# EAGLE design Quad_ESC_controller (EAGLE 9.6.2)
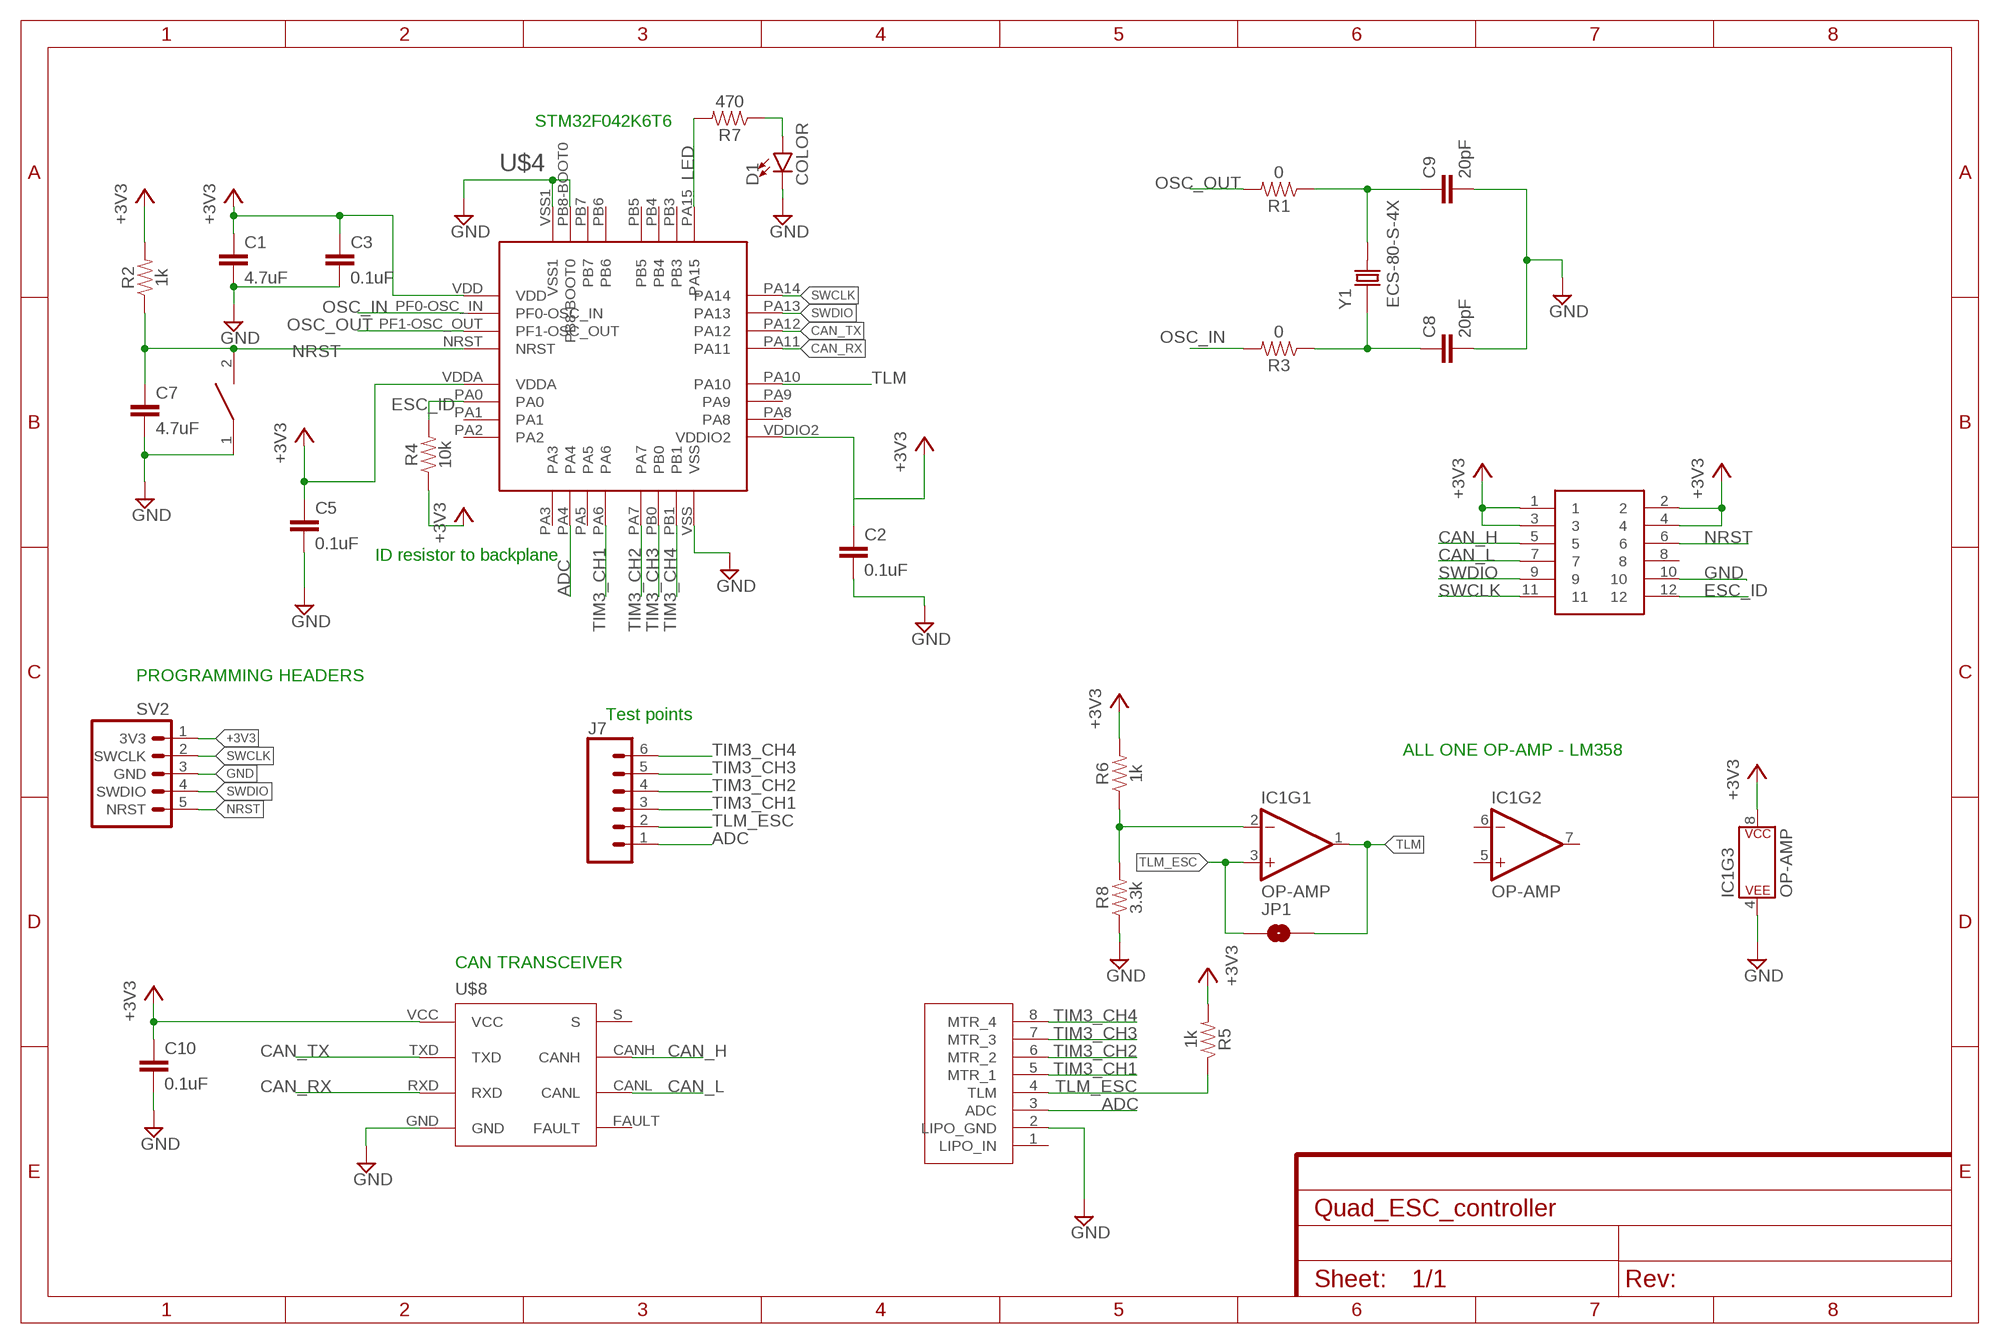
[diagram p0: schematic, sheet 1]

## Parts
C1  4.7uF  4.7UF0603  [0603]
C2  0.1uF  4.7UF0603  [0603]
C3  0.1uF  4.7UF0603  [0603]
C5  0.1uF  4.7UF0603  [0603]
C7  4.7uF  4.7UF0603  [0603]
C8  20pF  4.7UF0603  [0603]
C9  20pF  4.7UF0603  [0603]
C10  0.1uF  4.7UF0603  [0603]
D1  COLOR  LED-0805  [0805]
IC1  OP-AMP  OPAMP-DUALU  [SO08]
J7  CONN_06SILK_FEMALE_PTH  [1X06]
JP1  JUMPER-SMT_2_NO_SILK  [SMT-JUMPER_2_NO_SILK]
R1  0  1KOHM-0603-1/10W-1%  [0603]
R2  1k  1KOHM-0603-1/10W-1%  [0603]
R3  0  1KOHM-0603-1/10W-1%  [0603]
R4  10k  10KOHM-0603-1/10W-1%  [0603]
R5  1k  RESISTOR0603  [0603]
R6  1k  RESISTOR0603  [0603]
R7  470  RESISTOR0603  [0603]
R8  3.3k  RESISTOR0603  [0603]
RESET  DISCRETECOMPONENTS_SWITCH  [DISCRETECOMPONENTS_SW_2512]
SV2  3V3 -SWCLK-GND-SWDIO- NRST  SWD_CONN  [1X05]
U$2  JST-8PIN  [8PIN_CONNECTOR]
U$3  BACKPLANE_CONNECTORSESC  [BACKPLANE_CONNECTORS_ESC]
U$4  STM32F042K6T6  [STM32F042K6T6]
U$8  TCAN337D  [TCAN337D]
Y1  ECS-80-S-4X  [XTAL_ECS-80-S-4X]

## Nets
+3V3: C1.1 C2.1 C3.1 C5.1 C10.1 IC1.8(P$V+) R2.2 R4.1 R5.2 R6.2 SV2.1(3V3) U$3.1 U$3.2 U$3.3 U$3.4 U$4.VDD U$4.VDDA U$4.VDDIO2 U$8.VCC
ADC: J7.1 U$2.3(ADC) U$4.PA4
CAN_H: U$3.5 U$8.CANH
CAN_L: U$3.7 U$8.CANL
CAN_RX: U$4.PA11 U$8.RXD
CAN_TX: U$4.PA12 U$8.TXD
ESC_ID: R4.2 U$3.12 U$4.PA0
GND: C1.2 C2.2 C3.2 C5.2 C7.2 C8.2 C9.2 C10.2 D1.C IC1.4(P$V-) R8.1 RESET.1 SV2.3(GND) U$2.2(LIPO_GND) U$3.10 U$4.PB8-BOOT0 U$4.VSS U$4.VSS1 U$8.GND
LED: R7.2 U$4.PA15
N$1: C9.1 R1.1 Y1.2
N$2: C8.1 R3.1 Y1.1
N$6: IC1.2(-IN) R6.1 R8.2
N$24: D1.A R7.1
NRST: C7.1 R2.1 RESET.2 SV2.5(NRST) U$3.6 U$4.NRST
OSC_IN: R3.2 U$4.PF0-OSC_IN
OSC_OUT: R1.2 U$4.PF1-OSC_OUT
SWCLK: SV2.2(SWCLK) U$3.11 U$4.PA14
SWDIO: SV2.4(SWDIO) U$3.9 U$4.PA13
TIM3_CH1: J7.3 U$2.5(MTR_1) U$4.PA6
TIM3_CH2: J7.4 U$2.6(MTR_2) U$4.PA7
TIM3_CH3: J7.5 U$2.7(MTR_3) U$4.PB0
TIM3_CH4: J7.6 U$2.8(MTR_4) U$4.PB1
TLM: IC1.1(OUT) JP1.2 U$4.PA10
TLM_ESC: IC1.3(+IN) J7.2 JP1.1 R5.1 U$2.4(TLM)
Unconnected: IC1.5(+IN) IC1.6(-IN) IC1.7(OUT) U$2.1(LIPO_IN) U$3.8 U$4.PA1 U$4.PA2 U$4.PA3 U$4.PA5 U$4.PA8 U$4.PA9 U$4.PB3 U$4.PB4 U$4.PB5 U$4.PB6 U$4.PB7 U$8.FAULT U$8.S

## Notes on the sheet
- STM32F042K6T6
- ID resistor to backplane
- PROGRAMMING HEADERS
- Test points
- ALL ONE OP-AMP - LM358
- CAN TRANSCEIVER

## Library data of the parts
C1 C7 = SparkFun-Capacitors:4.7UF: 4.7µF ceramic capacitors A capacitor is a passive two-terminal electrical component used to store electrical energy temporarily in an electric field.; PROD_ID: CAP-08280
C2 C3 C5 C8-C10 = SparkFun-Capacitors:4.7UF: 4.7µF ceramic capacitors A capacitor is a passive two-terminal electrical component used to store electrical energy temporarily in an electric field.; PROD_ID: CAP-08280; VALUE: 4.7uF
D1 = LED, 0805:LED-0805
IC1 = SparkFun-IC-Amplifiers:OPAMP-DUAL: Generic op-amp footprint This component is for the standard 358 pinning of a dual op-amp From the LM358 datasheet: Pin 1: Output A Pin 2: Inverting Input A Pin 3: Non-Inverting Input A Pin 4: Gnd Pin 5: Non-Inverting Input B Pin 6: Inverting Input B Pin 7: Output B Pin 8: V+; PROD_ID: NA-XXXXX
J7 = SparkFun-Connectors:CONN_06: Multi connection point. Often used as Generic Header-pin footprint for 0.1 inch spaced/style header connections On any of the 0.1 inch spaced packages, you can populate with these: Break Away Headers - Straight <https://www.sparkfun.com/products/116> (PRT-00116) Break Away Male Headers - Right Angle <https://www.sparkfun.com/products/553> (PRT-00553) Female Headers <https://www.sparkfun.com/products/115> (PRT-00115) Break Away Headers - Machine Pin <https://www.sparkfun.com/products/117> (PRT-00117) Break Away Female Headers - Swiss Machine Pin <https://www.sparkfun.com/products/743> (PRT-00743) Arduino Stackable Header - 6 Pin <https://www.sparkfun.com/products/9280> (PRT-09280) For SCREWTERMINALS and SPRING TERMINALS visit here: Screw Terimnals on SparkFun.com <https://www.sparkfun.com/search/results?term=Screw+Terminals> (5mm/3.5mm/2.54mm spacing) This device is also useful as a general connection point to wire up your design to another part of your project. Our various solder wires solder well into these plated through hole pads. Hook-Up Wire - Assortment (Stranded, 22 AWG) <https://www.sparkfun.com/products/11375> (PRT-11375) Hook-Up Wire - Assortment (Solid Core, 22 AWG) <https://www.sparkfun.com/products/11367> (PRT-11367) View the entire wire category on our website here <https://www.sparkfun.com/categories/141>; PROD_ID: CONN-08437
JP1 = SparkFun-Jumpers:JUMPER-SMT_2_NO: Normally open jumper This jumper has two pads in close proximity to each other. Apply solder to close the connection. Round pads are easier to solder for beginners, but are a lot larger. SparkFun Product that uses the round pads: SparkFun EL Sequencer <https://www.sparkfun.com/products/12781>
R1 R3 = SparkFun-Resistors:1KOHM: 1kΩ resistor A resistor is a passive two-terminal electrical component that implements electrical resistance as a circuit element. Resistors act to reduce current flow, and, at the same time, act to lower voltage levels within circuits. - Wikipedia; PROD_ID: RES-07856; VALUE: 1k
R2 = SparkFun-Resistors:1KOHM: 1kΩ resistor A resistor is a passive two-terminal electrical component that implements electrical resistance as a circuit element. Resistors act to reduce current flow, and, at the same time, act to lower voltage levels within circuits. - Wikipedia; PROD_ID: RES-07856
R4 = SparkFun-Resistors:10KOHM: 10kΩ resistor A resistor is a passive two-terminal electrical component that implements electrical resistance as a circuit element. Resistors act to reduce current flow, and, at the same time, act to lower voltage levels within circuits. - Wikipedia; PROD_ID: RES-00824
R5-R8 = SparkFun-Resistors:RESISTOR: Generic Resistor Package
RESET = Push button - FSM2JMTR:DISCRETECOMPONENTS_SWITCH
SV2 = CONN, Serial Wire Programming Headers:SWD_CONN
U$2 = JST 8 pin:JST-8PIN: SM08B-SRSS-TB(LF)(SN)
U$3 = BLHeli_32 45A:BACKPLANE_CONNECTORS: Use samtec TMM and MMS
U$4 = PI_Shield_Library:STM32F042K6T6
U$8 = PI_Shield_Library:TCAN337D
Y1 = ECS-80-S-4X:ECS-80-S-4X: CRYSTAL T/H; DESCRIPTION: Crystal 8MHz Series 2-Pin HC-49/U; DIGI-KEY_PART_NUMBER: X1057-ND; DIGI-KEY_PURCHASE_URL: https://www.digikey.com/product-detail/en/ecs-inc/ECS-80-S-4X/X1057-ND/827549?utm_source=snapeda&utm_medium=aggregator&utm_campaign=symbol; MF: ECS International; MP: ECS-80-S-4X; PACKAGE: HC-49/US ECS International

## Net classes
0 default: width 0.203 mm

## Board
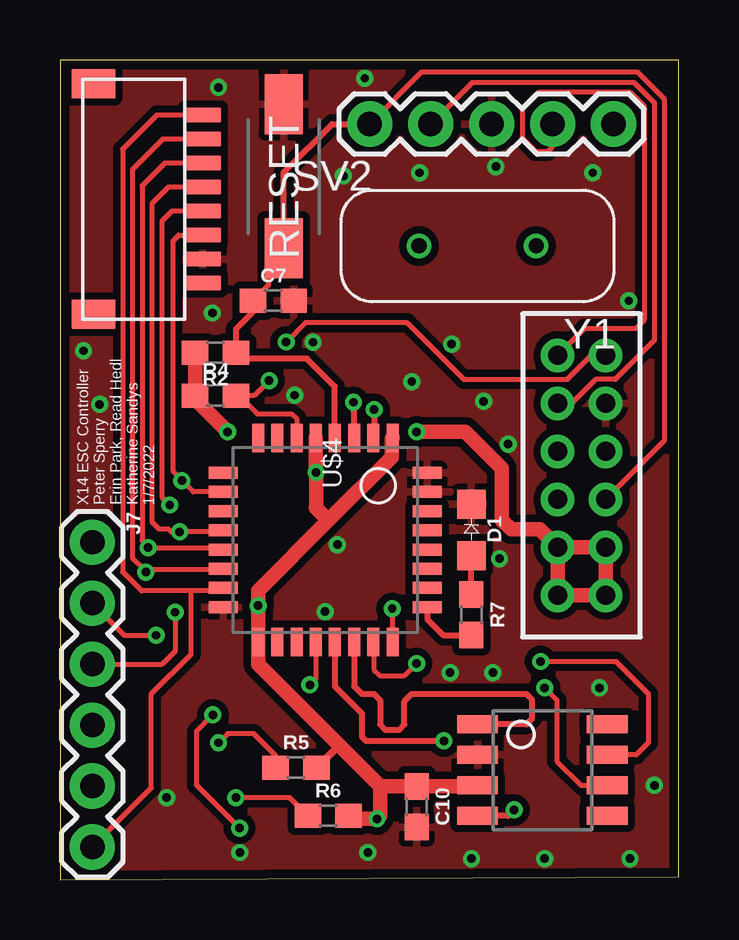
[diagram p1: board, top side]
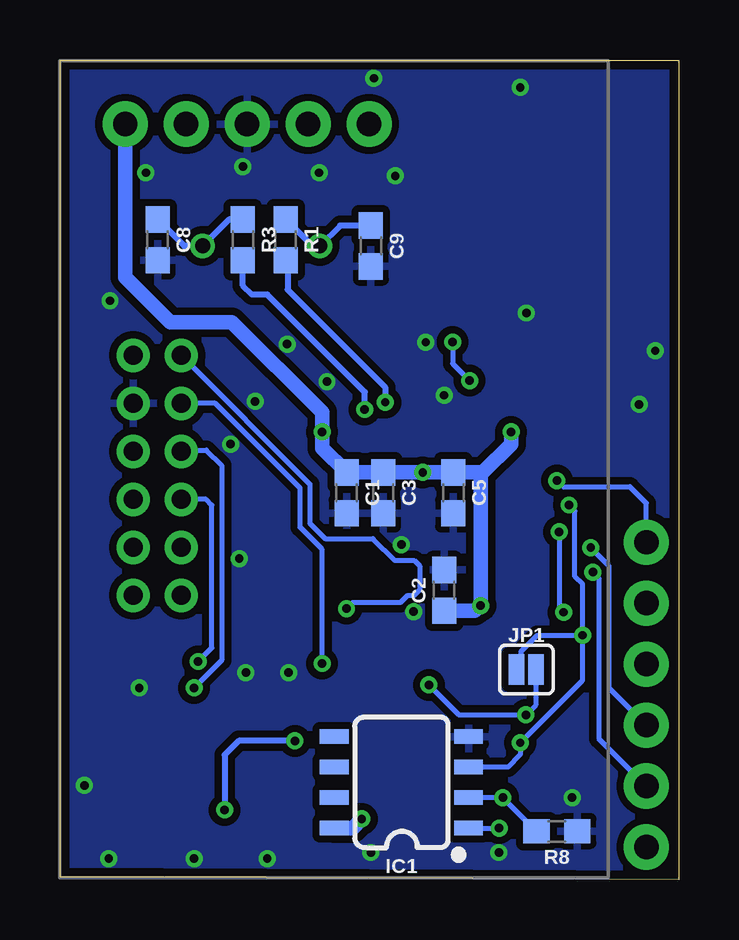
[diagram p2: board, bottom side, seen from below]

Size 25.78 x 34.16 mm. Coordinates in mm from the lower left corner, seen from the top.
Outline: 0,0 25.78,0.13 25.78,34.16 0,34.16 0,0
Copper layers (1*16): Top 0.0356mm / dielectric 1.5011mm / Bottom 0.0356mm
Design rules "ECE_Senior_Design": minimum track width 8mil, minimum drill 13mil, track to track 8mil, track to pad 8mil, pad to pad 6mil, via to via 8mil, smd to smd 6mil, copper to edge 15mil, drill to drill 8mil, minimum pad ring 7mil, minimum via ring 7mil, stop-mask expansion 3mil, vias tented up to drill 0mil, thermal gap 10mil

### Footprints (pad centres in the part's own frame; a part is rotated, then mirrored left to right if it is on the bottom)
0603 = smd 1.1 x 1: 1 -0.85,0; 2 0.85,0
0805 = smd 1.2 x 1.2: A 1.1,0; C -1.05,0
SO08 = smd 0.6 x 1.2: 1 -1.905,-2.8; 2 -0.635,-2.8; 3 0.635,-2.8; 4 1.905,-2.8; 5 1.905,2.8; 6 0.635,2.8; 7 -0.635,2.8; 8 -1.905,2.8
1X06 = drill 1.016 pad 1.88: 1 0,0; 2 2.54,0; 3 5.08,0; 4 7.62,0; 5 10.16,0; 6 12.7,0
SMT-JUMPER_2_NO_SILK = smd 0.635 x 1.27: 1 -0.406,0; 2 0.406,0
DISCRETECOMPONENTS_SW_2512 = smd 2.5 x 1.6: 1 -3,0; 2 3,0
1X05 = drill 1.016 pad 1.88: 1 0,0; 2 2.54,0; 3 5.08,0; 4 7.62,0; 5 10.16,0
8PIN_CONNECTOR = smd 0.6 x 1.5: 1 1.5,-0.75; 2 2.5,-0.75; 3 3.5,-0.75; 4 4.5,-0.75; 5 5.5,-0.75; 6 6.5,-0.75; 7 7.5,-0.75; 8 8.5,-0.75 | smd 1.2 x 1.8: MECH1 0.2,3.81; MECH2 9.8,3.81
BACKPLANE_CONNECTORS_ESC = drill 0.79 pad 1.39: 1 -1,-5; 2 1,-5; 3 -1,-3; 4 1,-3; 5 -1,-1; 6 1,-1; 7 -1,1; 8 1,1; 9 -1,3; 10 1,3; 11 -1,5; 12 1,5
STM32F042K6T6 = smd 1.2 x 0.5: NRST 0,3.2; PA0 0,1.6; PA1 0,0.8; PA2 0,0; PA8 8.5,0.8; PA9 8.5,1.6; PA10 8.5,2.4; PA11 8.5,3.2; PA12 8.5,4; PA13 8.5,4.8; PA14 8.5,5.6; PF0-OSC_IN 0,4.8; PF1-OSC_OUT 0,4; VDD 0,5.6; VDDA 0,2.4; VDDIO2 8.5,0 | smd 0.5 x 1.2: PA3 1.45,-1.45; PA4 2.25,-1.45; PA5 3.05,-1.45; PA6 3.85,-1.45; PA7 4.65,-1.45; PA15 7.05,7.05; PB0 5.45,-1.45; PB1 6.25,-1.45; PB3 6.25,7.05; PB4 5.45,7.05; PB5 4.65,7.05; PB6 3.85,7.05; PB7 3.05,7.05; PB8-BOOT0 2.25,7.05; VSS 7.05,-1.45; VSS1 1.45,7.05
TCAN337D = smd 1.7 x 0.75: CANH 5.4,2.54; CANL 5.4,1.27; FAULT 5.4,0; GND 0,2.54; RXD 0,0; S 5.4,3.81; TXD 0,3.81; VCC 0,1.27
XTAL_ECS-80-S-4X = drill 0.63 pad 1.03: 1 -2.44,0; 2 2.44,0

### Placement (x,y rotation side)
C1  13.84,16.13 270 bottom
C2  9.78,12.06 90 bottom
C3  12.32,16.13 270 bottom
C5  9.4,16.13 270 bottom
C7  8.89,24.13 0 top
C8  21.72,26.67 270 bottom
C9  12.83,26.42 270 bottom
C10  14.86,3.05 270 top
D1  17.14,14.61 270 top
IC1  11.56,4.06 90 bottom
J7  1.35,14.07 270 top
JP1  6.35,8.76 0 bottom
R1  16.38,26.67 270 bottom
R2  6.48,21.97 180 top
R3  18.16,26.67 270 bottom
R4  6.48,20.18 0 top
R5  9.83,4.67 0 top
R6  11.18,2.67 0 top
R7  17.14,11.05 270 top
R8  5.08,2.03 180 bottom
RESET  9.32,29.31 270 top
SV2  23.06,31.5 180 top
U$2  5.21,23.37 90 top
U$3  21.73,16.86 0 top
U$4  8.26,18.41 270 top
U$8  17.4,2.67 0 top
Y1  17.4,26.42 180 top

### Tracks (layer width: path | path; a pad name or v marks a point on that pad's centre or on a via)
+3V3  (via drill 0.35)
  Top 0.203: 11.58,5.58 11.67,5.58
  Top 0.305: R5.2 11.58,5.58
  Top 0.61: U$3.3 U$3.1 U$3.2 U$3.4 U$3.3 | U$4.VDD 13.81,18.37 13.81,17.61 11.19,14.98 | 11.19,14.98 8.26,12.05 v8.26,11.43 U$4.VDDIO2 8.26,9 11.67,5.58 13.35,3.9 | 11.19,14.98 10.65,15.51 10.67,15.52 v10.67,16.98 10.65,16.99 U$4.VDDA | 13.35,3.9 C10.1 17.36,3.9 U$8.VCC | U$3.3 19.98,14.61 18.8,14.61 18.41,14.99 18.41,17.14 16.89,18.67 v14.86,18.67 | v6.99,18.67 5.63,20.03 R4.1 R2.2 | R6.2 12.15,2.54 v13.21,2.54 13.34,2.67 13.34,3.88 13.35,3.9
  Bottom 0.61: IC1.8 13.59,2.16 v13.21,2.54 | C2.1 8.51,11.21 8.26,11.47 8.26,16.89 8.17,16.98 | SV2.1 23.06,25.12 21.19,23.24 18.62,23.24 14.86,19.48 v14.86,18.67 14.86,18 C1.1 C3.1 v10.67,16.98 C5.1 8.17,16.98 | v6.99,18.67 6.99,18.16 8.17,16.98
ADC  (via drill 0.35)
  Top 0.203: U$2.3 4.95,26.87 4.7,26.62 4.7,17.02 v5.08,16.64 5.55,16.16 U$4.PA4
  Bottom 0.203: J7.1 1.35,15.7 2.03,16.38 4.83,16.38 v5.08,16.64
CAN_H  (via drill 0.35)
  Top 0.203: v20.02,9.1 23.16,9.1 24.51,7.75 24.51,5.71 24,5.21 U$8.CANH
  Bottom 0.203: v20.02,9.1 19.46,9.67 19.46,15.62 19.69,15.86 U$3.5
CAN_L  (via drill 0.35)
  Top 0.203: v20.19,8 20.7,7.49 20.7,4.95 21.72,3.94 U$8.CANL
  Bottom 0.203: U$3.7 20.68,17.91 19.68,17.91 19.05,17.27 19.05,9.14 v20.19,8
CAN_RX  (via drill 0.35)
  Top 0.254: v18.92,2.92 18.67,2.67 U$8.RXD | U$4.PA11 11.46,8.06 12.57,6.94 12.57,5.97 12.75,5.79 v15.99,5.79
  Bottom 0.254: v15.99,5.79 18.34,5.79 18.92,5.21 v18.92,2.92
CAN_TX
  Top 0.254: U$4.PA12 12.26,8.06 12.57,7.75 13.08,7.75 13.34,7.49 13.34,6.48 13.56,6.25 14.12,6.25 14.35,6.48 14.35,7.44 14.66,7.75 19.43,7.75 19.66,7.52 19.66,6.71 19.43,6.48 U$8.TXD
ESC_ID  (via drill 0.35)
  Top 0.203: U$4.PA0 9.86,19.23 9.66,19.42 8.22,19.42 7.45,20.18 R4.2 8.09,20.18 v8.71,20.8 | U$3.12 22.14,21.86 21.14,20.86 16.82,20.86 14.46,23.22 10.23,23.22 v9.42,22.41
  Bottom 0.203: v9.42,22.41 9.42,21.51 v8.71,20.8
GND  (via drill 0.35)
  other vias: 1.65,19.81 0.98,22.05 9.78,20.19 6.35,23.62 10.54,22.4 6.6,33.02 12.7,33.4 11.81,29.34 14.99,29.46 18.16,29.72 22.2,29.46 23.7,24.13 16.32,22.33 14.66,20.76 17.65,19.94 18.67,18.16 18.31,13.39 11.56,13.97 11.05,11.18 16.26,8.64 18.03,8.64 22.48,8 24.77,3.94 23.75,0.89 20.19,0.89 17.14,0.89 7.49,1.14 12.83,1.14 4.45,3.43
  pour Top (isolate 0.305): -0.51,35.69 26.29,35.69 27.81,34.16 27.81,0.64 26.29,-0.89 -0.38,-0.89 -1.65,0.38 -1.65,34.54
  pour Bottom (isolate 0.305): 0.13,35.43 26.04,35.43 27.3,34.16 27.3,0.64 26.29,-0.38 0,-0.38 -1.14,0.76 -1.14,34.16
LED
  Top 0.254: U$4.PA15 15.3,10.86 15.96,10.2 R7.2
N$1
  Bottom 0.254: C9.1 14.11,27.27 Y1.2 15.28,26.42 R1.1
N$2
  Bottom 0.254: R3.1 18.73,27.52 Y1.1 20.61,26.42 C8.1
N$6  (via drill 0.35)
  Top 0.203: R6.1 9.56,3.43 v7.33,3.43
  Bottom 0.203: R8.2 v7.33,3.43 IC1.2
N$24
  Top 0.254: R7.1 D1.A
NRST
  Top 0.203: U$3.6 25.17,18.3 25.17,32.55 24.07,33.66 15.06,33.66 SV2.5 | RESET.2 8.69,25.68 8.69,24.78 C7.1
  Top 0.254: U$4.NRST 11.46,20.55 10.29,21.72 7.58,21.72 R2.1 7.33,22.95 8.04,23.66 C7.1 | RESET.2 9.32,29.48 11.34,31.5 SV2.5
OSC_IN  (via drill 0.35)
  Top 0.254: v13.09,19.6 13.09,18.45 U$4.PF0-OSC_IN
  Bottom 0.254: v13.09,19.6 v13.08,19.61 13.08,20.32 17.14,24.38 17.78,24.38 18.16,24.77 18.16,25.51 18.15,25.53 18.15,25.81 R3.2
OSC_OUT  (via drill 0.35)
  Top 0.254: v12.23,19.9 12.23,18.44 U$4.PF1-OSC_OUT
  Bottom 0.254: R1.2 16.32,25.82 16.29,25.79 16.29,24.6 12.23,20.54 v12.23,19.9
SWCLK  (via drill 0.35)
  Top 0.203: U$3.11 21.86,22.99 24,22.99 24.36,23.34 24.36,32.22 23.76,32.82 19.94,32.82 19.25,32.13 19.25,30.91 19.81,30.35 20.32,30.35 20.52,30.56 SV2.2 | v13.84,11.3 13.84,9.93 U$4.PA14
  Bottom 0.203: U$3.11 15.37,16.49 15.37,14.86 14.73,14.22 12.74,14.22 11.83,13.31 11.03,13.31 10.79,13.08 10.79,12.09 11.05,11.83 11.32,11.83 11.6,11.56 13.59,11.56 v13.84,11.3
SWDIO  (via drill 0.35)
  Top 0.203: U$3.9 21.32,19.86 22.32,20.86 23.14,20.86 24.77,22.48 24.77,32.38 23.93,33.22 17.17,33.22 SV2.4 | U$4.PA13 13.08,9.89 13.08,8.76 13.34,8.51 14.35,8.51 v14.86,9.02
  Bottom 0.203: v14.86,9.02 14.86,13.78 15.77,14.69 15.77,16.32 19.3,19.86 U$3.9
TIM3_CH1  (via drill 0.35)
  Top 0.203: U$2.5 4.51,28.87 3.82,28.18 3.82,14.92 4.13,14.62 4.51,14.62 4.63,14.5 v4.98,14.5 6.74,14.5 U$4.PA6 | v4.8,11.15 4.8,9.52 4.27,8.99 J7.3
  Bottom 0.203: v4.98,14.5 4.98,11.34 v4.8,11.15
TIM3_CH2  (via drill 0.35)
  Top 0.203: U$2.6 4.36,29.87 3.42,28.93 3.42,14.14 3.69,13.87 | v3.67,13.84 3.69,13.87 | 3.69,13.87 3.72,13.84 6.73,13.84 U$4.PA7
  Bottom 0.203: J7.4 2.91,8.01 2.91,13.08 v3.67,13.84
TIM3_CH3  (via drill 0.35)
  Top 0.203: U$4.PB0 6.75,12.91 3.58,12.91 | 3.58,12.91 3.51,12.91 3.01,13.41 3.01,29.6 4.28,30.87 U$2.7 | v3.58,12.82 3.58,12.91
  Bottom 0.203: J7.5 3.32,5.89 3.32,12.57 v3.58,12.82
TIM3_CH4
  Top 0.203: U$2.8 4.03,31.87 2.6,30.45 2.6,12.84 3.4,12.04 5.46,12.04 | 5.46,12.04 6.68,12.04 U$4.PB1 | J7.6 3.81,3.83 3.81,7.75 5.46,9.4 5.46,12.04
TLM  (via drill 0.35)
  Top 0.203: U$4.PA10 10.65,8.37 v10.41,8.13 | v7.49,2.16 5.69,3.95 5.69,6.2 v6.37,6.88
  Bottom 0.203: IC1.1 v7.49,2.16 | v10.41,8.13 9.16,6.88 v6.37,6.88 5.94,7.3 JP1.2
TLM_ESC  (via drill 0.35)
  Top 0.203: U$2.4 4.66,27.87 4.24,27.45 4.24,15.95 v4.57,15.62 | v6.6,5.71 6.99,6.1 8.06,6.1 8.98,5.18 R5.1 | J7.2 2.69,10.19 v4,10.19
  Bottom 0.203: 8.63,4.7 IC1.3 7.11,4.7 6.6,5.21 v6.6,5.71 4.01,8.31 v4.01,10.19 v4,10.19 | v4,10.19 4,12.32 4.33,12.64 4.33,15.38 v4.57,15.62 | JP1.1 6.57,8.95 6.57,9.52 5.9,10.19 v4,10.19

### Text on the board
tNames: X14 ESC Controller / Peter Sperry / Erin Park, Read Hedl / Katherine Sandys / 1/7/2022
200bmp: C:/Users/Rach s PC/Desktop/kingsman logo.bmp'